# Altium schematic sheet Sheet4.SchDoc
size A
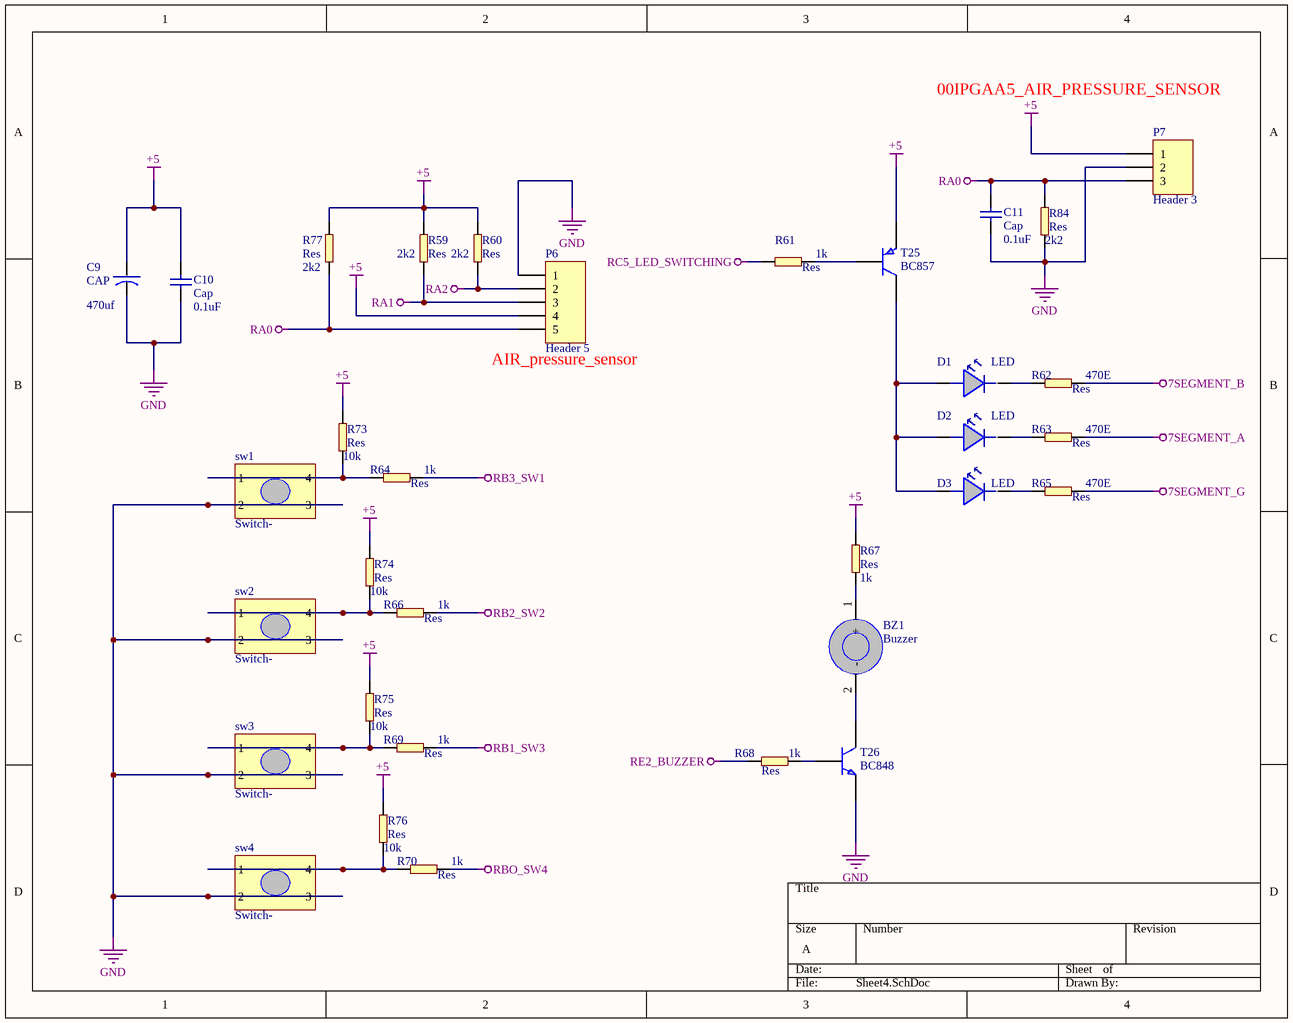
[diagram p0: Sheet4.SchDoc]

## Parts
BZ1  Buzzer  [Buzze]
C9  CAP  value 470uf  [Capacitor]
C10  Cap  [RES0805]
C11  Cap  [RES0805]
D1  LED  [LED3MM]
D2  LED  [LED3MM]
D3  LED  [LED3MM]
P6  Header 5  [HDR1X5]
P7  Header 3  [HDR1X3]
R59  Res  value 2k2  [RES0805]
R60  Res  value 2k2  [RES0805]
R61  Res  value 1k  [RES0805]
R62  Res  value 470E  [RES0805]
R63  Res  value 470E  [RES0805]
R64  Res  value 1k  [RES0805]
R65  Res  value 470E  [RES0805]
R66  Res  value 1k  [RES0805]
R67  Res  value 1k  [RES0805]
R68  Res  value 1k  [RES0805]
R69  Res  value 1k  [RES0805]
R70  Res  value 1k  [RES0805]
R73  Res  value 10k  [RES0805]
R74  Res  value 10k  [RES0805]
R75  Res  value 10k  [RES0805]
R76  Res  value 10k  [RES0805]
R77  Res  value 2k2  [RES0805]
R84  Res  value 2k2  [RES0805]
sw1  Switch-  [switch_200/250]
sw2  Switch-  [switch_200/250]
sw3  Switch-  [switch_200/250]
sw4  Switch-  [switch_200/250]
T25  BC857  [SOT23]
T26  BC848  [SOT23]

## Nets
7SEGMENT_A: R63.2(b)
7SEGMENT_B: R62.2(b)
7SEGMENT_G: R65.2(b)
+5: C9.1(a) C10.1(A) P6.4 P7.1 R59.1(a) R60.1(a) R67.2(b) R73.2(b) R74.2(b) R75.2(b) R76.2(b) R77.2(b) T25.2(E)
GND: C9.2(b) C10.2(A) C11.1(A) P6.1 P7.2 R84.2(b) sw1.2 sw1.3 sw2.2 sw2.3 sw3.2 sw3.3 sw4.2 sw4.3 T26.2(E)
RA0: C11.2(A) P6.5 P7.3 R77.1(a) R84.1(a)
RA1: P6.3 R59.2(b)
RA2: P6.2 R60.2(b)
RB1_SW3: R69.2(b)
RB2_SW2: R66.2(b)
RB3_SW1: R64.2(b)
RBO_SW4: R70.2(b)
RC5_LED_SWITCHING: R61.1(a)
RE2_BUZZER: R68.1(a)
NetBZ1_1: BZ1.1(+) R67.1(a)
NetBZ1_2: BZ1.2(-) T26.3(C)
NetD1_1: D1.1(A) D2.1(A) D3.1(A) T25.3(C)
NetD1_2: D1.2(B) R62.1(a)
NetD2_2: D2.2(B) R63.1(a)
NetD3_2: D3.2(B) R65.1(a)
NetR61_2: R61.2(b) T25.1(B)
NetR64_1: R64.1(a) R73.1(a) sw1.1 sw1.4
NetR66_1: R66.1(a) R74.1(a) sw2.1 sw2.4
NetR68_2: R68.2(b) T26.1(B)
NetR69_1: R69.1(a) R75.1(a) sw3.1 sw3.4
NetR70_1: R70.1(a) R76.1(a) sw4.1 sw4.4

## Notes on the sheet
- 00IPGAA5_AIR_PRESSURE_SENSOR
- (near P6) AIR_pressure_sensor
- (in symbol CAP_104_SMD) 0.1uF

## Library data of the parts
BZ1 = Buzzer_small
C9 = CAP_GT_SMD: 470uf
C10 C11 = CAP_104_SMD
D1-D3 = LED_3MM
P6 = Header 5: Header, 5-Pin; LatestRevisionDate: 17-Jul-2002; LatestRevisionNote: Re-released for DXP Platform.; Publisher: Altium Limited
P7 = Header 3: Header, 3-Pin; LatestRevisionDate: 17-Jul-2002; LatestRevisionNote: Re-released for DXP Platform.; Publisher: Altium Limited
R59-R70 R73-R77 R84 = Resistor: Res0805
sw1-sw4 = Switch-: 200/250mil
T26 = BC848: TRANSISTOR